# Altium schematic sheet 0168_V12_FAN GENERATION.SchDoc
size 848 x 558 mm
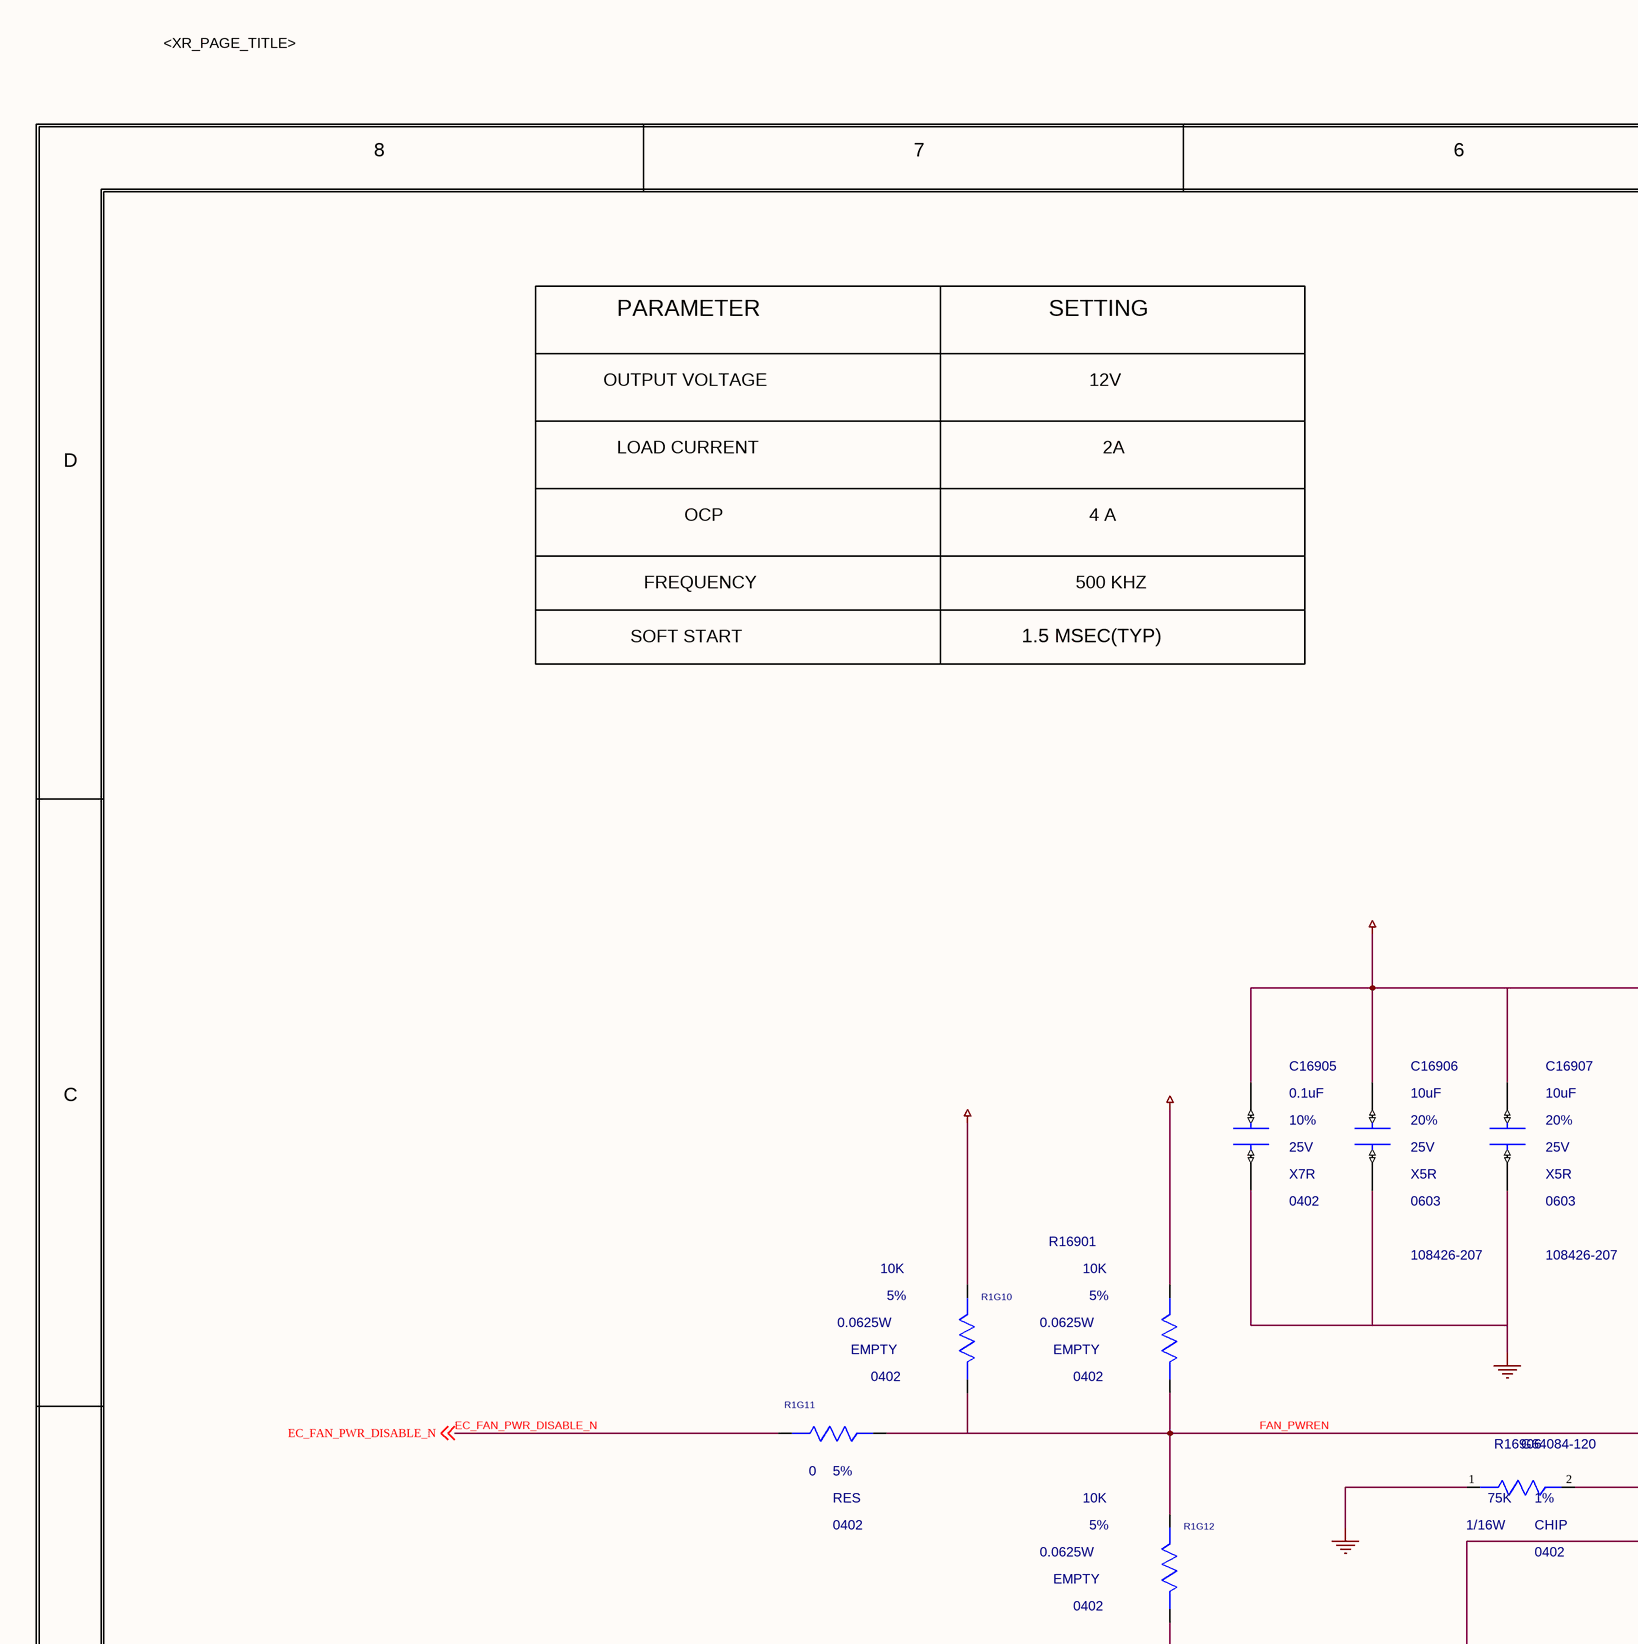
[diagram p0: 0168_V12_FAN GENERATION.SchDoc, top left]
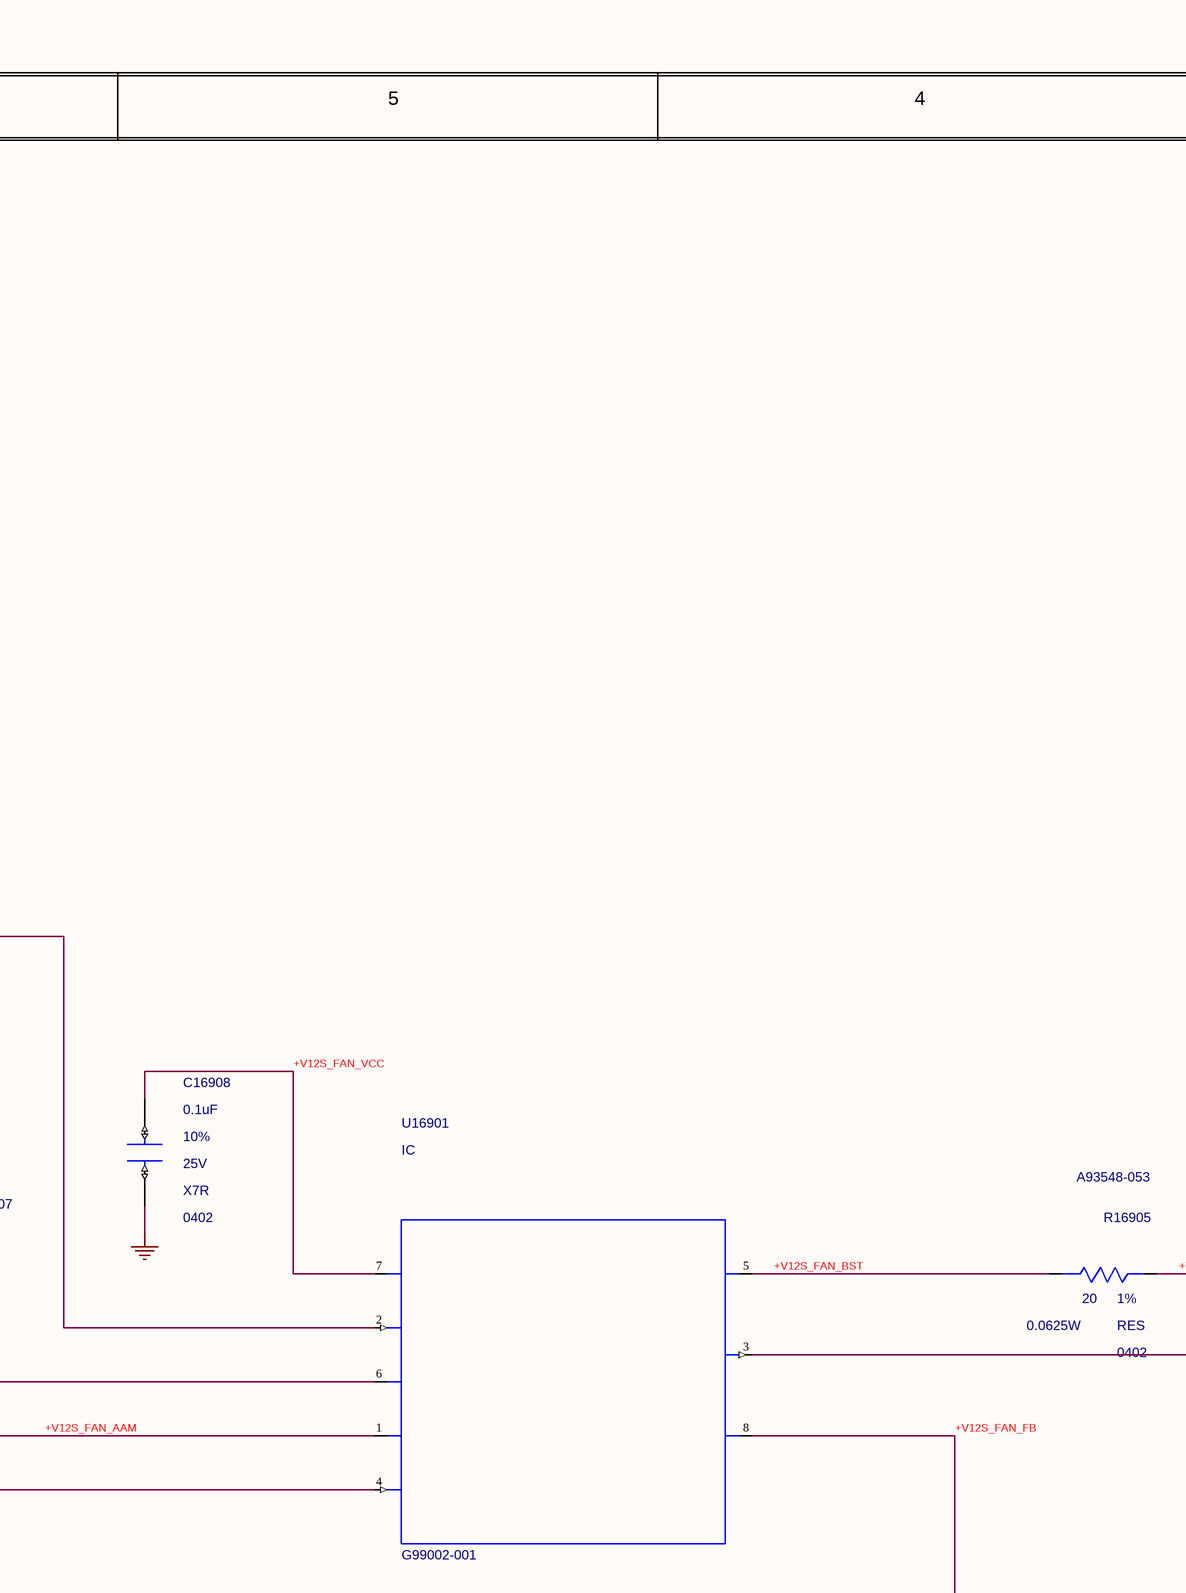
[diagram p1: 0168_V12_FAN GENERATION.SchDoc, top middle]
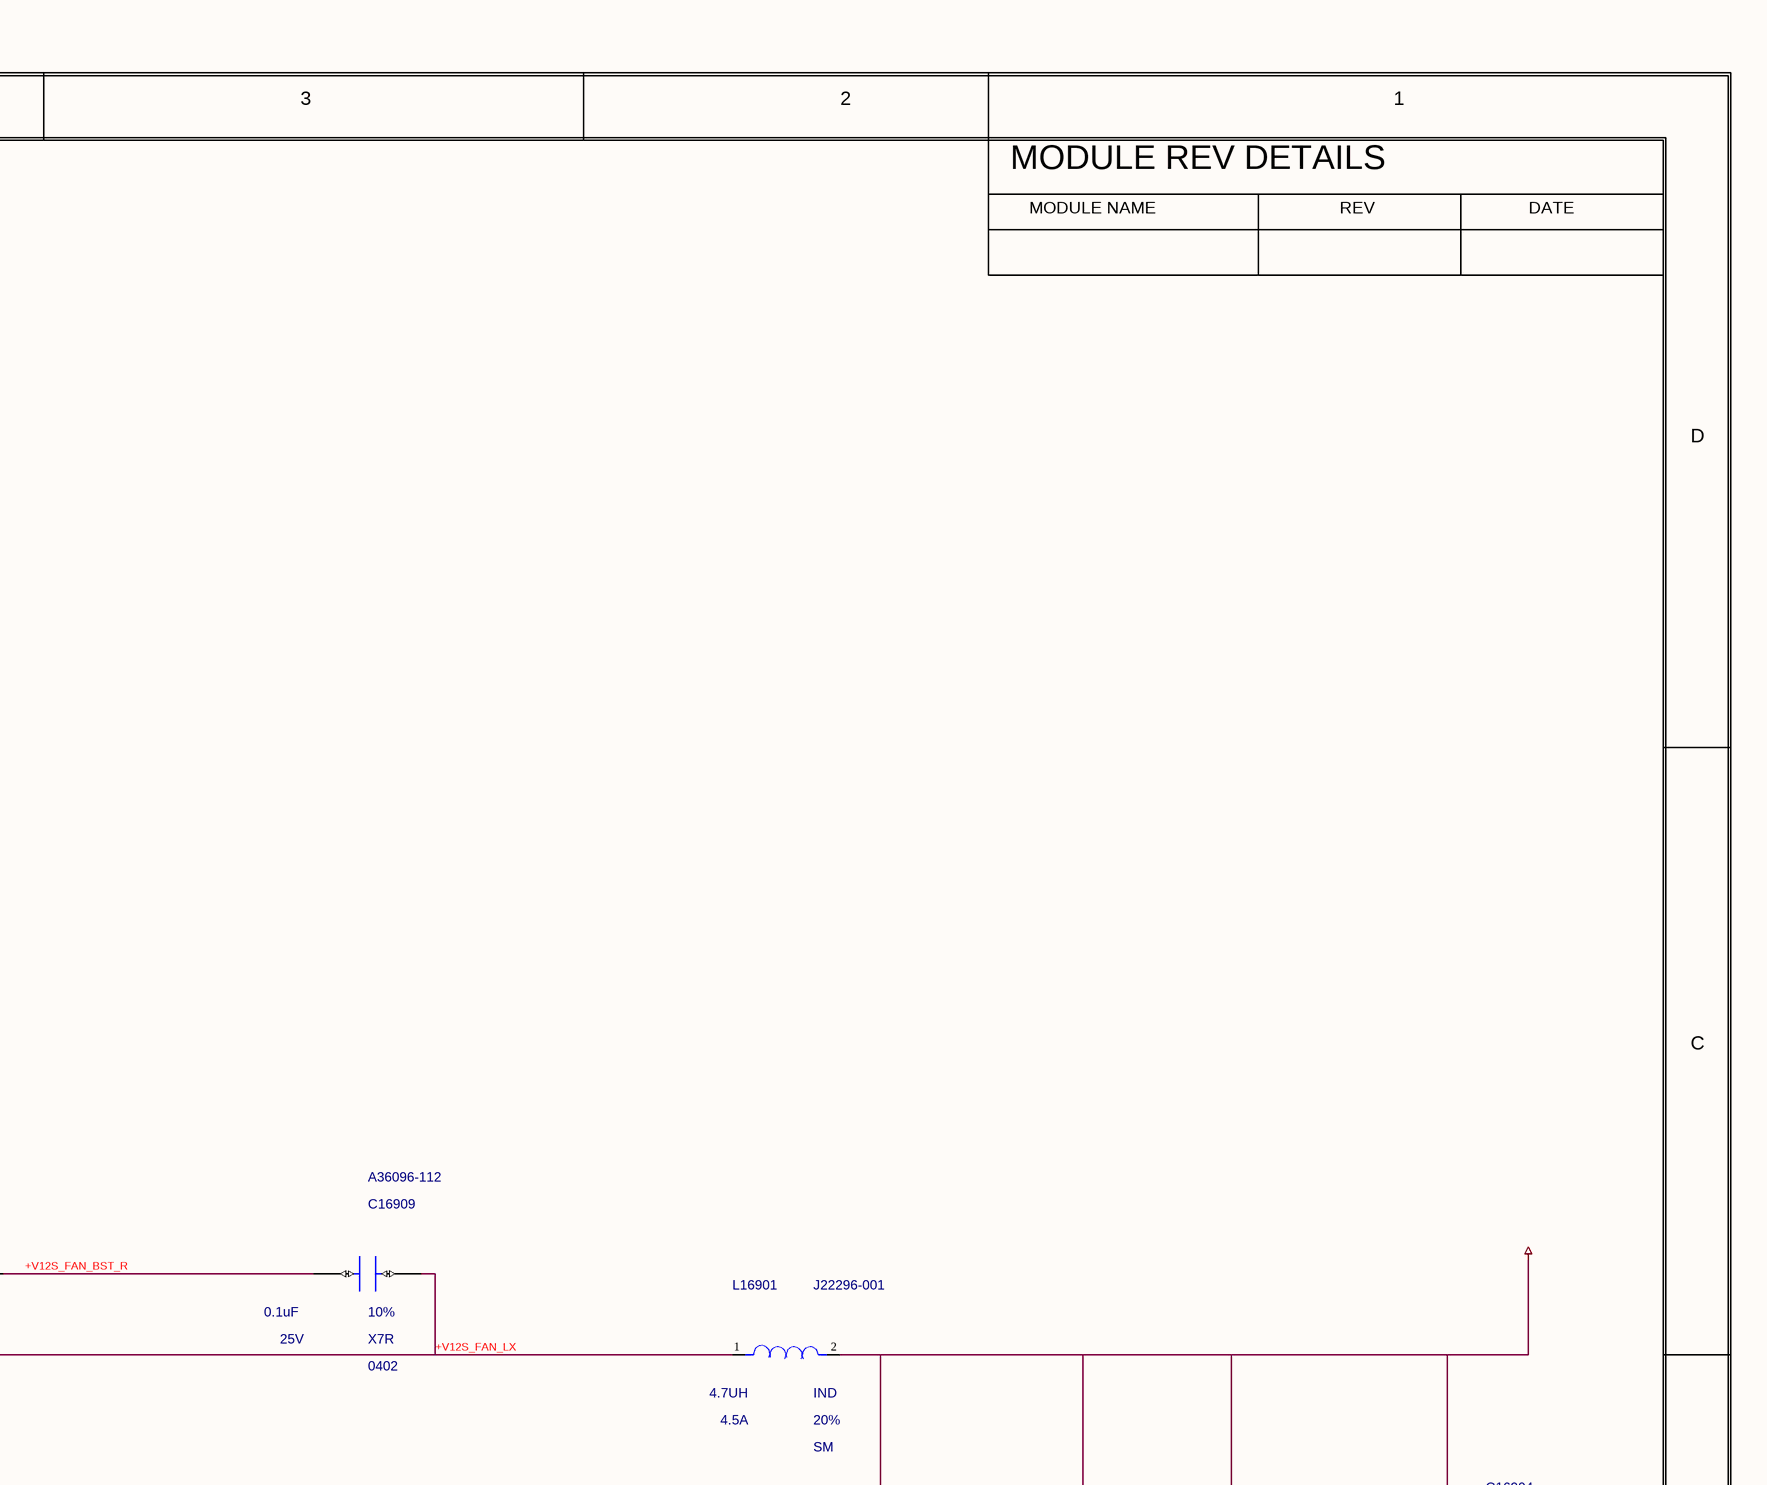
[diagram p2: 0168_V12_FAN GENERATION.SchDoc, top right]
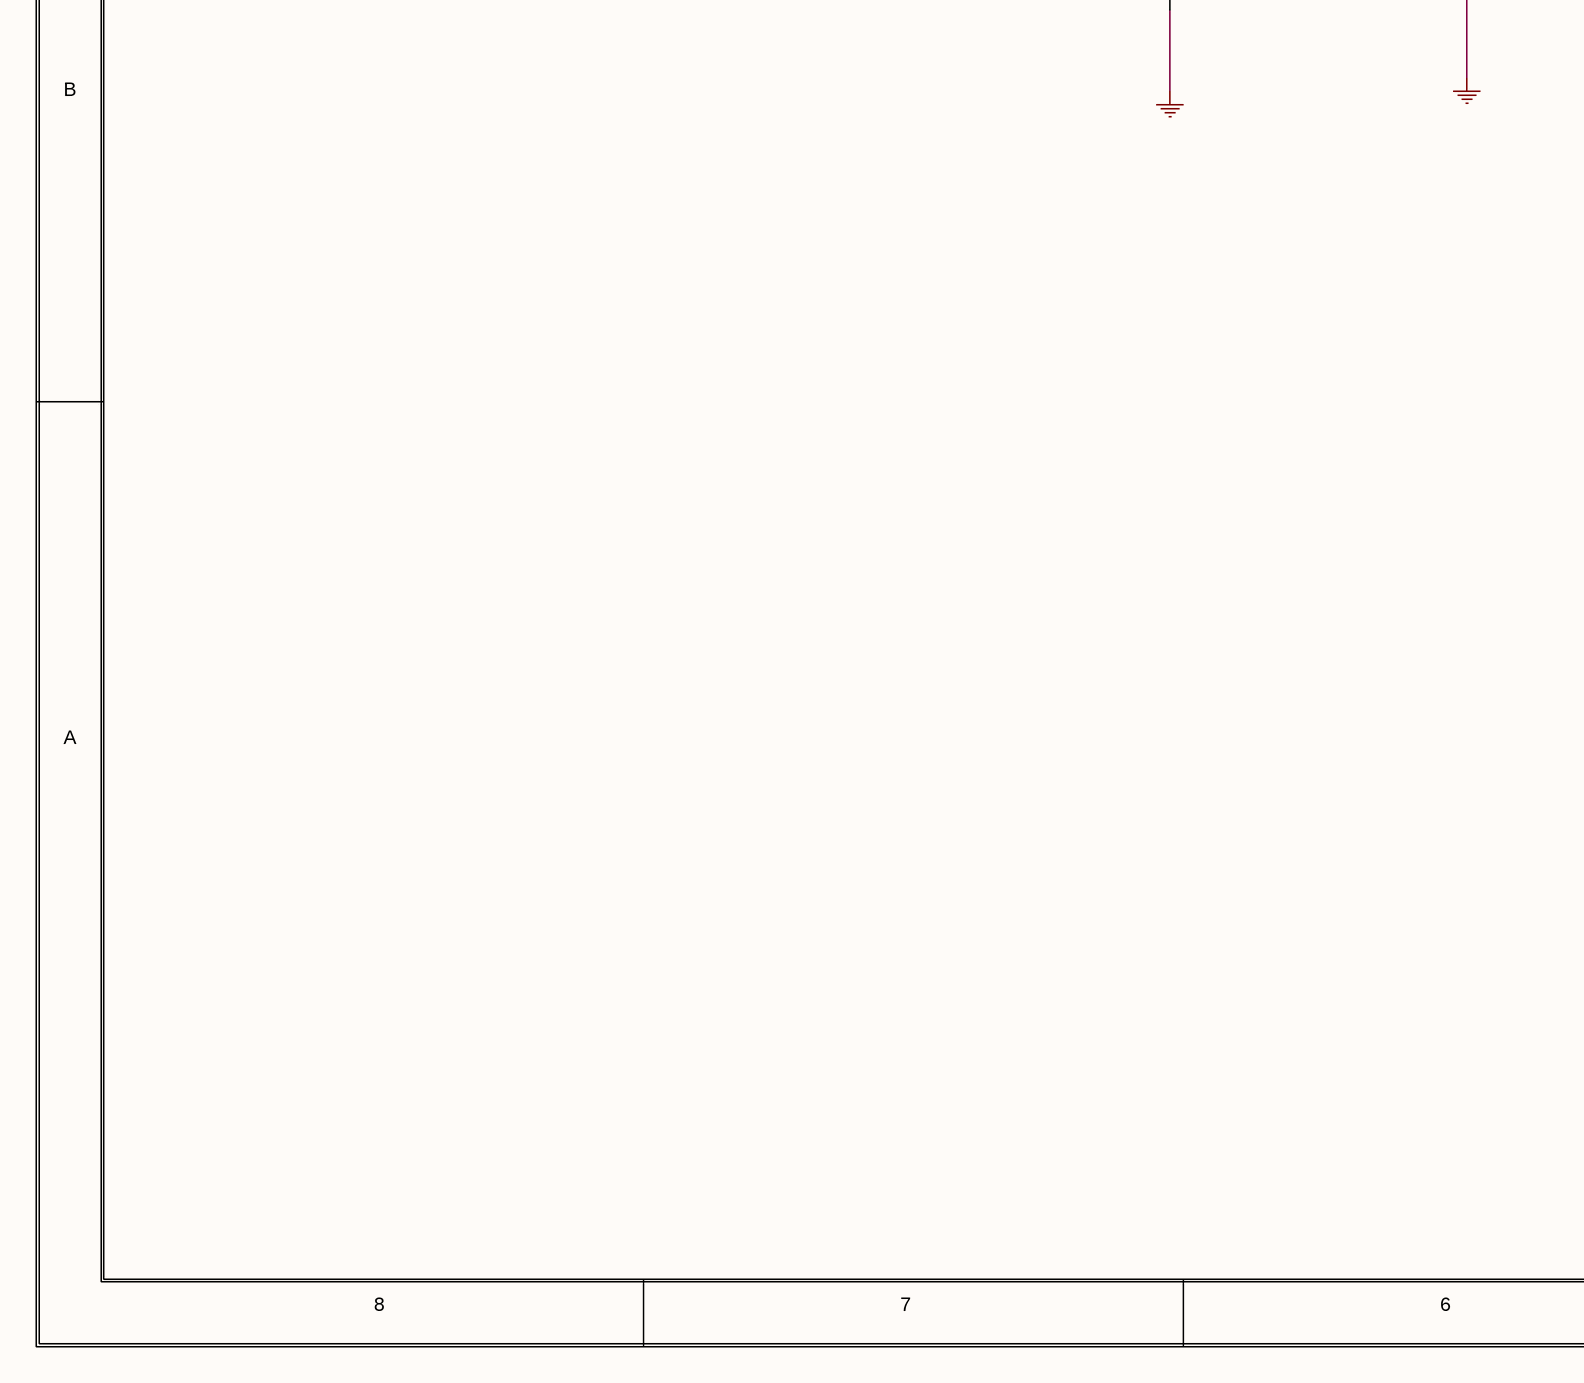
[diagram p3: 0168_V12_FAN GENERATION.SchDoc, bottom left]
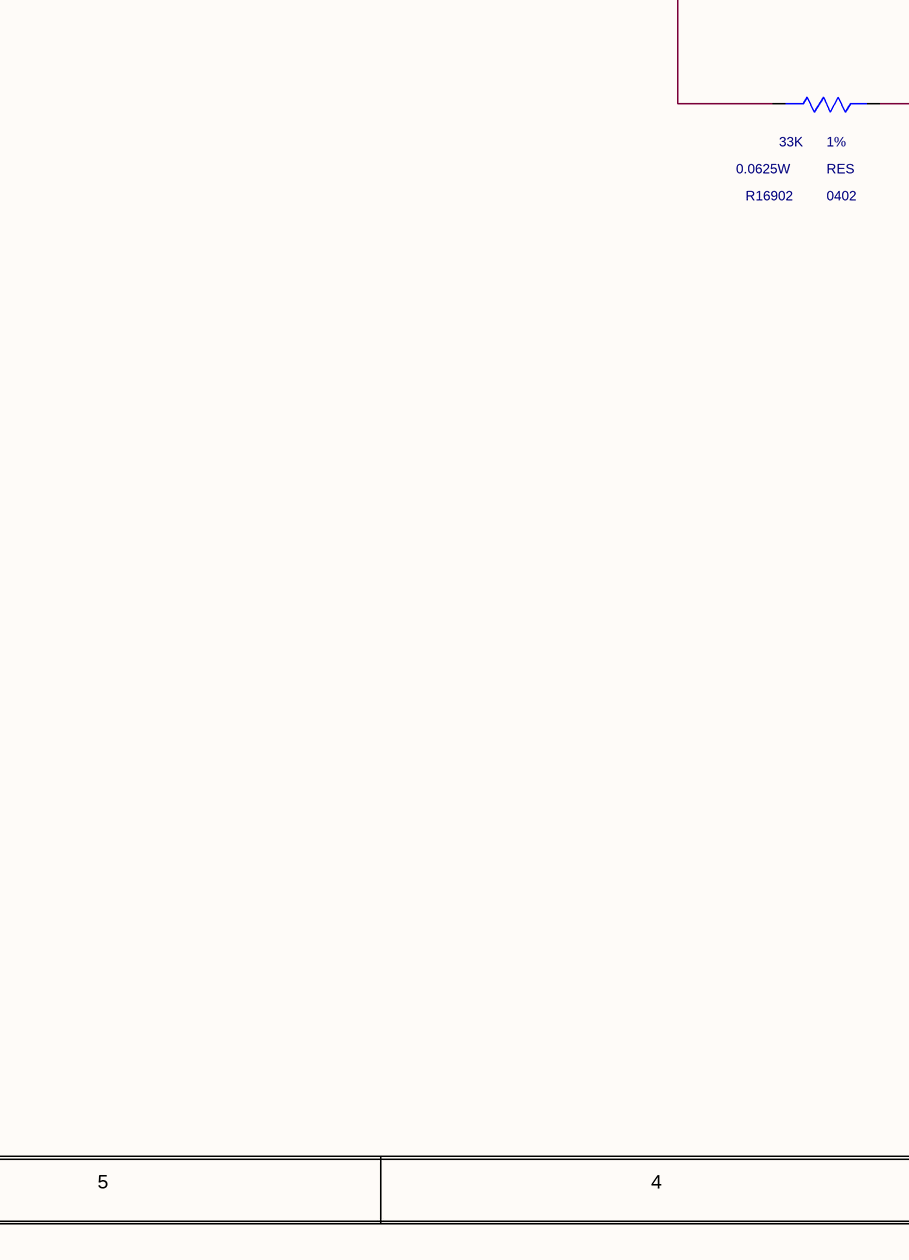
[diagram p4: 0168_V12_FAN GENERATION.SchDoc, bottom middle]
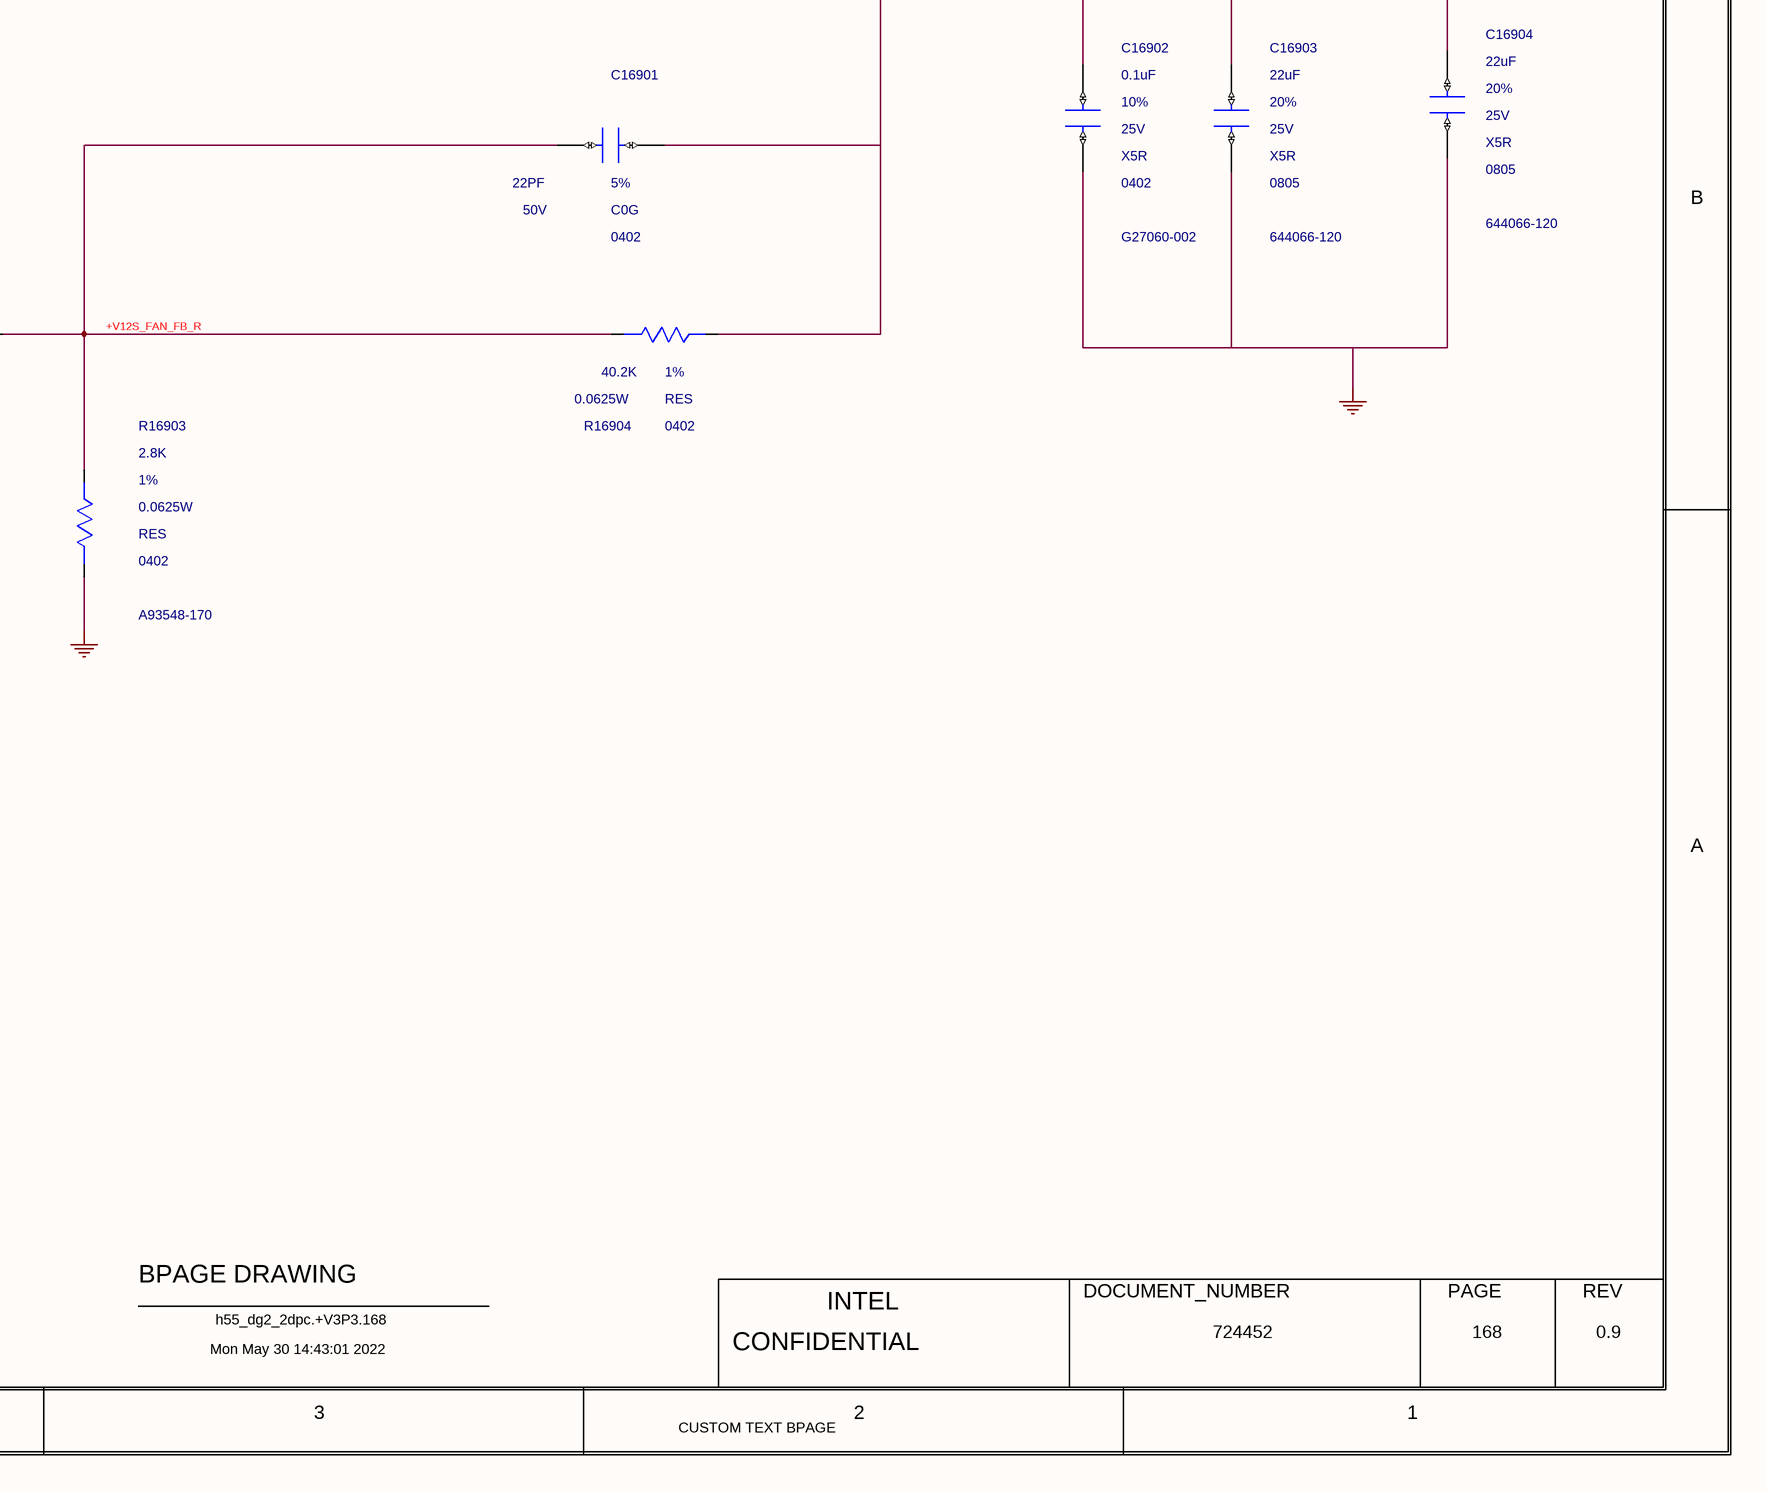
[diagram p5: 0168_V12_FAN GENERATION.SchDoc, bottom right]

## Parts
C16901  22PF  MATERIAL: C0G  PACK_TYPE: 0402  TOLERANCE: 5%  VOLTAGE: 50V  [CTK2_SM0402_1050X550_MA]
C16902  0.1uF  MATERIAL: X5R  PACK_TYPE: 0402  PART_NUMBER: G27060-002  TOLERANCE: 10%  VOLTAGE: 25V  [CTK2_SM0402_1050X550_MA]
C16903  22uF  MATERIAL: X5R  PACK_TYPE: 0805  PART_NUMBER: 644066-120  TOLERANCE: 20%  VOLTAGE: 25V  [CTK2_SM0805_2200X1450_MA]
C16904  22uF  MATERIAL: X5R  PACK_TYPE: 0805  PART_NUMBER: 644066-120  TOLERANCE: 20%  VOLTAGE: 25V  [CTK2_SM0805_2200X1450_MA]
C16905  0.1uF  MATERIAL: X7R  PACK_TYPE: 0402  TOLERANCE: 10%  VOLTAGE: 25V  [CTK2_SM0402_1050X550_MA]
C16906  10uF  MATERIAL: X5R  PACK_TYPE: 0603  PART_NUMBER: 108426-207  TOLERANCE: 20%  VOLTAGE: 25V  [CTK2_SM0603_1800X1000_MA]
C16907  10uF  MATERIAL: X5R  PACK_TYPE: 0603  PART_NUMBER: 108426-207  TOLERANCE: 20%  VOLTAGE: 25V  [CTK2_SM0603_1800X1000_MA]
C16908  0.1uF  MATERIAL: X7R  PACK_TYPE: 0402  TOLERANCE: 10%  VOLTAGE: 25V  [CTK2_SM0402_1050X550_MA]
C16909  0.1uF  MATERIAL: X7R  PACK_TYPE: 0402  PART_NUMBER: A36096-112  TOLERANCE: 10%  VOLTAGE: 25V  [CTK2_SM0402_1050X550_MA]
L16901  4.7UH  CURRENT: 4.5A  MATERIAL: IND  PACK_TYPE: SM  PART_NUMBER: J22296-001  TOLERANCE: 20%  [CTK0_SM_S4300_MB]
R1G10  10K  MATERIAL: EMPTY  PACK_TYPE: 0402  TOLERANCE: 5%  WATTAGE: 0.0625W  [CTK2_SM0402_1100X550_MA]
R1G11  0  MATERIAL: RES  PACK_TYPE: 0402  TOLERANCE: 5%  [CTK2_SM0402_1100X550_MA]
R1G12  10K  MATERIAL: EMPTY  PACK_TYPE: 0402  TOLERANCE: 5%  WATTAGE: 0.0625W  [CTK2_SM0402_1100X550_MA]
R16901  10K  MATERIAL: EMPTY  PACK_TYPE: 0402  TOLERANCE: 5%  WATTAGE: 0.0625W  [CTK2_SM0402_1100X550_MA]
R16902  33K  MATERIAL: RES  PACK_TYPE: 0402  TOLERANCE: 1%  WATTAGE: 0.0625W  [CTK0_SM0402_1050X550_MA]
R16903  2.8K  MATERIAL: RES  PACK_TYPE: 0402  PART_NUMBER: A93548-170  TOLERANCE: 1%  WATTAGE: 0.0625W  [CTK2_SM0402_1100X550_MA]
R16904  40.2K  MATERIAL: RES  PACK_TYPE: 0402  TOLERANCE: 1%  WATTAGE: 0.0625W  [CTK0_SM0402_1100X550_MA]
R16905  20  MATERIAL: RES  PACK_TYPE: 0402  PART_NUMBER: A93548-053  TOLERANCE: 1%  WATTAGE: 0.0625W  [CTK2_SM0402_1100X550_MA]
R16906  75K  MATERIAL: CHIP  PACK_TYPE: 0402  PART_NUMBER: G64084-120  TOLERANCE: 1%  WATTAGE: 1/16W  [SMR0402IA]
U16901  MATERIAL: IC  PART_NUMBER: G99002-001  [CTK2_TSOT23_8_1700X3000_650_MA]  (hidden comment: C_MP2314)

## Nets
+V3P3A: R16901.1(A)
+V3P3S: R1G10.1(A)
+V12S_FAN: C16901.2(B) C16902.1(A) C16903.1(A) C16904.1(A) L16901.2(INB) R16904.2(B)
+VBATA: C16905.1(A) C16906.1(A) C16907.1(A) U16901.2(IN)
GND: C16902.2(B) C16903.2(B) C16904.2(B) C16905.2(B) C16906.2(B) C16907.2(B) C16908.2(B) R1G12.2(B) R16903.2(B) R16906.1(A) U16901.4(GND)
+V12S_FAN_AAM: R16906.2(B) U16901.1(AAM)
+V12S_FAN_BST: R16905.1(A) U16901.5(BST)
+V12S_FAN_BST_R: C16909.1(A) R16905.2(B)
+V12S_FAN_FB: R16902.1(A) U16901.8(FB)
+V12S_FAN_FB_R: C16901.1(A) R16902.2(B) R16903.1(A) R16904.1(A)
+V12S_FAN_LX: C16909.2(B) L16901.1(INA) U16901.3(SW)
+V12S_FAN_VCC: C16908.1(A) U16901.7(VCC)
EC_FAN_PWR_DISABLE_N: R1G11.1(A) ; off-sheet EC_FAN_PWR_DISABLE_N
FAN_PWREN: R1G10.2(B) R1G11.2(B) R1G12.1(A) R16901.2(B) U16901.6(EN_SYNC)

## Notes on the sheet
- <XR_PAGE_TITLE>
- 8
- 7
- 6
- 5
- 4
- 3
- 2
- 1
- MODULE REV DETAILS
- PARAMETER
- SETTING
- MODULE NAME
- REV
- DATE
- OUTPUT VOLTAGE
- 12V
- LOAD CURRENT
- 2A
- D
- OCP
- 4 A
- FREQUENCY
- 500 KHZ
- SOFT START
- 1.5 MSEC(TYP)
- C
- B
- A
- BPAGE DRAWING
- INTEL
- DOCUMENT_NUMBER
- PAGE
- Mon May 30 14:43:01 2022
- h55_dg2_2dpc.+V3P3.168
- CONFIDENTIAL
- 724452
- 168
- 0.9
- CUSTOM TEXT BPAGE

## Library data of the parts
C16901 = C_CAP#1: PART_NUMBER: A36095-030; CHIPS_PART_NAME: C_CAP; CDS_PHYS_PART_NAME: C_CAP_0402-A36095-030,C0G,22PF,50V,5%,TK2,GENERIC; CDS_LMAN_SYM_OUTLINE: -50,50,50,-50; FP_TECH: TK2; IP: GENERIC; ROOM: NONE; OriginalSymbolOrigin: (-25,50); XY: (2000,-375); VER: 2; ROT: 0; PHYS_PAGE: 168; LOCATION: C16901; DRAWING: @RVP1_ADL_SB_ADP_S_DDR5_SODIMM_2DPC_LIB.H55_DG2_2DPC(SCH_1):PAGE537; CDS_LIB: c_discrete; VARIANT: ?; PCB Footprint: CTK2_SM0402_1050X550_MA; CDS_PART_NAME: C_CAP_0402-A36095-030,C0G,22PF,50V,5%,TK2,GENERIC; CDS_LOCATION: C16901
C16902 = C_CAP: CDS_PHYS_PART_NAME: C_CAP_0402-G27060-002,X5R,0.1UF,25V,10%,TK2,GENERIC; CDS_LMAN_SYM_OUTLINE: -50,50,50,-50; FP_TECH: TK2; IP: GENERIC; ROOM: NONE; OriginalSymbolOrigin: (-50,25); XY: (2875,-325); VER: 1; ROT: 0; PHYS_PAGE: 168; LOCATION: C16902; DRAWING: @RVP1_ADL_SB_ADP_S_DDR5_SODIMM_2DPC_LIB.H55_DG2_2DPC(SCH_1):PAGE537; CDS_LIB: c_discrete; VARIANT: ?; PCB Footprint: CTK2_SM0402_1050X550_MA; CHIPS_PART_NAME: C_CAP; CDS_PART_NAME: C_CAP_0402-G27060-002,X5R,0.1UF,25V,10%,TK2,GENERIC; CDS_LOCATION: C16902
C16903 = C_CAP: CDS_PHYS_PART_NAME: C_CAP_0805-644066-120,X5R,22UF,25V,20%,TK2,GENERIC; CDS_LMAN_SYM_OUTLINE: -50,50,50,-50; FP_TECH: TK2; IP: GENERIC; ROOM: NONE; OriginalSymbolOrigin: (-50,25); XY: (3150,-325); VER: 1; ROT: 0; PHYS_PAGE: 168; LOCATION: C16903; DRAWING: @RVP1_ADL_SB_ADP_S_DDR5_SODIMM_2DPC_LIB.H55_DG2_2DPC(SCH_1):PAGE537; CDS_LIB: c_discrete; VARIANT: ?; PCB Footprint: CTK2_SM0805_2200X1450_MA; CHIPS_PART_NAME: C_CAP; CDS_PART_NAME: C_CAP_0805-644066-120,X5R,22UF,25V,20%,TK2,GENERIC; CDS_LOCATION: C16903
C16904 = C_CAP: CDS_PHYS_PART_NAME: C_CAP_0805-644066-120,X5R,22UF,25V,20%,TK2,GENERIC; CDS_LMAN_SYM_OUTLINE: -50,50,50,-50; FP_TECH: TK2; IP: GENERIC; ROOM: NONE; OriginalSymbolOrigin: (-50,25); XY: (3550,-300); VER: 1; ROT: 0; PHYS_PAGE: 168; LOCATION: C16904; DRAWING: @RVP1_ADL_SB_ADP_S_DDR5_SODIMM_2DPC_LIB.H55_DG2_2DPC(SCH_1):PAGE537; CDS_LIB: c_discrete; VARIANT: ?; PCB Footprint: CTK2_SM0805_2200X1450_MA; CHIPS_PART_NAME: C_CAP; CDS_PART_NAME: C_CAP_0805-644066-120,X5R,22UF,25V,20%,TK2,GENERIC; CDS_LOCATION: C16904
C16905 = C_CAP: PART_NUMBER: A36096-112; CDS_PHYS_PART_NAME: C_CAP_0402-A36096-112,X7R,0.1UF,25V,10%,TK2,GENERIC; CDS_LMAN_SYM_OUTLINE: -50,50,50,-50; FP_TECH: TK2; IP: GENERIC; ROOM: NONE; OriginalSymbolOrigin: (-50,25); XY: (-1925,575); VER: 1; ROT: 0; PHYS_PAGE: 168; LOCATION: C16905; DRAWING: @RVP1_ADL_SB_ADP_S_DDR5_SODIMM_2DPC_LIB.H55_DG2_2DPC(SCH_1):PAGE537; CDS_LIB: c_discrete; VARIANT: ?; PCB Footprint: CTK2_SM0402_1050X550_MA; CHIPS_PART_NAME: C_CAP; CDS_PART_NAME: C_CAP_0402-A36096-112,X7R,0.1UF,25V,10%,TK2,GENERIC; CDS_LOCATION: C16905
C16906 = C_CAP: CDS_PHYS_PART_NAME: C_CAP_0603-108426-207,X5R,10UF,25V,20%,TK2,GENERIC; CDS_LMAN_SYM_OUTLINE: -50,50,50,-50; FP_TECH: TK2; IP: GENERIC; ROOM: NONE; OriginalSymbolOrigin: (-50,25); XY: (-1700,575); VER: 1; ROT: 0; PHYS_PAGE: 168; LOCATION: C16906; DRAWING: @RVP1_ADL_SB_ADP_S_DDR5_SODIMM_2DPC_LIB.H55_DG2_2DPC(SCH_1):PAGE537; CDS_LIB: c_discrete; VARIANT: ?; PCB Footprint: CTK2_SM0603_1800X1000_MA; CHIPS_PART_NAME: C_CAP; CDS_PART_NAME: C_CAP_0603-108426-207,X5R,10UF,25V,20%,TK2,GENERIC; CDS_LOCATION: C16906
C16907 = C_CAP: CDS_PHYS_PART_NAME: C_CAP_0603-108426-207,X5R,10UF,25V,20%,TK2,GENERIC; CDS_LMAN_SYM_OUTLINE: -50,50,50,-50; FP_TECH: TK2; IP: GENERIC; ROOM: NONE; OriginalSymbolOrigin: (-50,25); XY: (-1450,575); VER: 1; ROT: 0; PHYS_PAGE: 168; LOCATION: C16907; DRAWING: @RVP1_ADL_SB_ADP_S_DDR5_SODIMM_2DPC_LIB.H55_DG2_2DPC(SCH_1):PAGE537; CDS_LIB: c_discrete; VARIANT: ?; PCB Footprint: CTK2_SM0603_1800X1000_MA; CHIPS_PART_NAME: C_CAP; CDS_PART_NAME: C_CAP_0603-108426-207,X5R,10UF,25V,20%,TK2,GENERIC; CDS_LOCATION: C16907
C16908 = C_CAP: PART_NUMBER: A36096-112; CDS_PHYS_PART_NAME: C_CAP_0402-A36096-112,X7R,0.1UF,25V,10%,TK2,GENERIC; CDS_LMAN_SYM_OUTLINE: -50,50,50,-50; FP_TECH: TK2; IP: GENERIC; ROOM: NONE; OriginalSymbolOrigin: (-50,25); XY: (-1000,450); VER: 1; ROT: 0; PHYS_PAGE: 168; LOCATION: C16908; DRAWING: @RVP1_ADL_SB_ADP_S_DDR5_SODIMM_2DPC_LIB.H55_DG2_2DPC(SCH_1):PAGE537; CDS_LIB: c_discrete; VARIANT: ?; PCB Footprint: CTK2_SM0402_1050X550_MA; CHIPS_PART_NAME: C_CAP; CDS_PART_NAME: C_CAP_0402-A36096-112,X7R,0.1UF,25V,10%,TK2,GENERIC; CDS_LOCATION: C16908
C16909 = C_CAP#1: CHIPS_PART_NAME: C_CAP; CDS_PHYS_PART_NAME: C_CAP_0402-A36096-112,X7R,0.1UF,25V,10%,TK2,GENERIC; CDS_LMAN_SYM_OUTLINE: -50,50,50,-50; FP_TECH: TK2; IP: GENERIC; ROOM: NONE; OriginalSymbolOrigin: (-25,50); XY: (1550,225); VER: 2; ROT: 0; PHYS_PAGE: 168; LOCATION: C16909; DRAWING: @RVP1_ADL_SB_ADP_S_DDR5_SODIMM_2DPC_LIB.H55_DG2_2DPC(SCH_1):PAGE537; CDS_LIB: c_discrete; VARIANT: ?; PCB Footprint: CTK2_SM0402_1050X550_MA; CDS_PART_NAME: C_CAP_0402-A36096-112,X7R,0.1UF,25V,10%,TK2,GENERIC; CDS_LOCATION: C16909
L16901 = C_INDUCTOR: CDS_PHYS_PART_NAME: C_INDUCTOR_SM-J22296-001,IND,4.7UH,20%,4.5A,TK0,GENERIC; CDS_LMAN_SYM_OUTLINE: -100,50,100,-50; FP_TECH: TK0; IP: GENERIC; ROOM: NONE; OriginalSymbolOrigin: (-75,25); XY: (2325,75); VER: 1; ROT: 0; PHYS_PAGE: 168; LOCATION: L16901; DRAWING: @RVP1_ADL_SB_ADP_S_DDR5_SODIMM_2DPC_LIB.H55_DG2_2DPC(SCH_1):PAGE537; CDS_LIB: local; VARIANT: ?; PCB Footprint: CTK0_SM_S4300_MB; CHIPS_PART_NAME: C_INDUCTOR; CDS_PART_NAME: C_INDUCTOR_SM-J22296-001,IND,4.7UH,20%,4.5A,TK0,GENERIC; CDS_LOCATION: L16901
R1G10 = C_RES: PART_NUMBER: A93549-023; CDS_PHYS_PART_NAME: RES_402-10K,1%,402"; CDS_PART_NAME: C_RES_0402-A93549-023,EMPTY,10K,5%,0.0625W,TK2,GENERIC; CDS_LMAN_SYM_OUTLINE: -50,50,50,-50; FP_TECH: TK2; IP: GENERIC; ROOM: NONE; OriginalSymbolOrigin: (-25,75); XY: (-2450,200); VER: 2; PHYS_PAGE: 168; LOCATION: R1G10; DRAWING: @RVP1_ADL_SB_ADP_S_DDR5_SODIMM_2DPC_LIB.H55_DG2_2DPC(SCH_1):PAGE537; CDS_LIB: c_discrete; VARIANT: ?; PCB Footprint: CTK2_SM0402_1100X550_MA; ROT: 2; CHIPS_PART_NAME: C_RES; CDS_LOCATION: R1G10; ASI_MODEL: A93549-023
R1G11 = C_RES#1: PART_NUMBER: A93549-001; CHIPS_PART_NAME: C_RES; CDS_PHYS_PART_NAME: RES_402-0,5%,402"; CDS_PART_NAME: C_RES_0402-A93549-001,RES,0,5%,0.0625W,TK2,GENERIC; CDS_LMAN_SYM_OUTLINE: -50,50,50,-50; FP_TECH: TK2; IP: GENERIC; ROOM: NONE; WATTAGE: 0.0625W; OriginalSymbolOrigin: (-75,25); XY: (-2700,25); VER: 1; PHYS_PAGE: 168; LOCATION: R1G11; DRAWING: @RVP1_ADL_SB_ADP_S_DDR5_SODIMM_2DPC_LIB.H55_DG2_2DPC(SCH_1):PAGE537; CDS_LIB: c_discrete; VARIANT: ?; PCB Footprint: CTK2_SM0402_1100X550_MA; ROT: 0; CDS_LOCATION: R1G11; ASI_MODEL: A93549-001
R1G12 = C_RES: PART_NUMBER: A93549-023; CDS_PHYS_PART_NAME: RES_402-10K,1%,402,E"; CDS_PART_NAME: C_RES_0402-A93549-023,EMPTY,10K,5%,0.0625W,TK2,GENERIC; CDS_LMAN_SYM_OUTLINE: -50,50,50,-50; FP_TECH: TK2; IP: GENERIC; ROOM: NONE; OriginalSymbolOrigin: (-25,75); XY: (-2075,-225); VER: 2; PHYS_PAGE: 168; LOCATION: R1G12; DRAWING: @RVP1_ADL_SB_ADP_S_DDR5_SODIMM_2DPC_LIB.H55_DG2_2DPC(SCH_1):PAGE537; CDS_LIB: c_discrete; VARIANT: ?; PCB Footprint: CTK2_SM0402_1100X550_MA; ROT: 2; CHIPS_PART_NAME: C_RES; CDS_LOCATION: R1G12; ASI_MODEL: A93549-023
R16901 = C_RES: PART_NUMBER: A93549-023; CDS_PHYS_PART_NAME: C_RES_0402-A93549-023,EMPTY,10K,5%,0.0625W,TK2,GENERIC; CDS_LMAN_SYM_OUTLINE: -50,50,50,-50; FP_TECH: TK2; IP: GENERIC; ROOM: NONE; OriginalSymbolOrigin: (-25,75); XY: (-2075,200); VER: 2; PHYS_PAGE: 168; LOCATION: R16901; DRAWING: @RVP1_ADL_SB_ADP_S_DDR5_SODIMM_2DPC_LIB.H55_DG2_2DPC(SCH_1):PAGE537; CDS_LIB: c_discrete; VARIANT: ?; PCB Footprint: CTK2_SM0402_1100X550_MA; ROT: 2; CHIPS_PART_NAME: C_RES; CDS_PART_NAME: C_RES_0402-A93549-023,EMPTY,10K,5%,0.0625W,TK2,GENERIC; CDS_LOCATION: R16901; ASI_MODEL: A93549-023
R16902 = C_RES#1: PART_NUMBER: A93548-640; CHIPS_PART_NAME: C_RES; CDS_PHYS_PART_NAME: C_RES_0402-A93548-640,RES,33K,1%,0.0625W,TK0,GENERIC; CDS_LMAN_SYM_OUTLINE: -50,50,50,-50; FP_TECH: TK0; IP: GENERIC; ROOM: NONE; OriginalSymbolOrigin: (-75,25); XY: (775,-725); VER: 1; ROT: 0; PHYS_PAGE: 168; LOCATION: R16902; DRAWING: @RVP1_ADL_SB_ADP_S_DDR5_SODIMM_2DPC_LIB.H55_DG2_2DPC(SCH_1):PAGE537; CDS_LIB: c_discrete; VARIANT: ?; PCB Footprint: CTK0_SM0402_1050X550_MA; CDS_PART_NAME: C_RES_0402-A93548-640,RES,33K,1%,0.0625W,TK0,GENERIC; CDS_LOCATION: R16902
R16903 = C_RES: CDS_PHYS_PART_NAME: C_RES_0402-A93548-170,RES,2.8K,1%,0.0625W,TK2,GENERIC; CDS_LMAN_SYM_OUTLINE: -50,50,50,-50; FP_TECH: TK2; IP: GENERIC; ROOM: NONE; OriginalSymbolOrigin: (-25,75); XY: (1025,-1075); VER: 2; ROT: 0; PHYS_PAGE: 168; LOCATION: R16903; DRAWING: @RVP1_ADL_SB_ADP_S_DDR5_SODIMM_2DPC_LIB.H55_DG2_2DPC(SCH_1):PAGE537; CDS_LIB: c_discrete; VARIANT: ?; PCB Footprint: CTK2_SM0402_1100X550_MA; CHIPS_PART_NAME: C_RES; CDS_PART_NAME: C_RES_0402-A93548-170,RES,2.8K,1%,0.0625W,TK2,GENERIC; CDS_LOCATION: R16903
R16904 = C_RES#1: PART_NUMBER: A93548-188; CHIPS_PART_NAME: C_RES; CDS_PHYS_PART_NAME: C_RES_0402-A93548-188,RES,40.2K,1%,0.0625W,TK0,GENERIC; CDS_LMAN_SYM_OUTLINE: -50,50,50,-50; FP_TECH: TK0; IP: GENERIC; ROOM: NONE; OriginalSymbolOrigin: (-75,25); XY: (2100,-725); VER: 1; ROT: 0; PHYS_PAGE: 168; LOCATION: R16904; DRAWING: @RVP1_ADL_SB_ADP_S_DDR5_SODIMM_2DPC_LIB.H55_DG2_2DPC(SCH_1):PAGE537; CDS_LIB: c_discrete; VARIANT: ?; PCB Footprint: CTK0_SM0402_1100X550_MA; CDS_PART_NAME: C_RES_0402-A93548-188,RES,40.2K,1%,0.0625W,TK0,GENERIC; CDS_LOCATION: R16904
R16905 = C_RES#1: CHIPS_PART_NAME: C_RES; CDS_PHYS_PART_NAME: C_RES_0402-A93548-053,RES,20,1%,0.0625W,TK2,GENERIC; CDS_LMAN_SYM_OUTLINE: -50,50,50,-50; FP_TECH: TK2; IP: GENERIC; ROOM: NONE; OriginalSymbolOrigin: (-75,25); XY: (775,225); VER: 1; ROT: 0; PHYS_PAGE: 168; LOCATION: R16905; DRAWING: @RVP1_ADL_SB_ADP_S_DDR5_SODIMM_2DPC_LIB.H55_DG2_2DPC(SCH_1):PAGE537; CDS_LIB: c_discrete; VARIANT: ?; PCB Footprint: CTK2_SM0402_1100X550_MA; CDS_PART_NAME: C_RES_0402-A93548-053,RES,20,1%,0.0625W,TK2,GENERIC; CDS_LOCATION: R16905
R16906 = RES#1: CHIPS_PART_NAME: RES; CDS_PHYS_PART_NAME: RES_0402-G64084-120,CHIP,75K,1%,1/16W,LPDB,GENERIC; OriginalSymbolOrigin: (-75,25); XY: (-1425,-75); VER: 1; ROT: 0; PHYS_PAGE: 168; LOCATION: R16906; IP: GENERIC; FP_TECH: LPDB; DRAWING: @RVP1_ADL_SB_ADP_S_DDR5_SODIMM_2DPC_LIB.H55_DG2_2DPC(SCH_1):PAGE537; CDS_LIB: discrete; PCB Footprint: SMR0402IA; CDS_PART_NAME: RES_0402-G64084-120,CHIP,75K,1%,1/16W,LPDB,GENERIC; CDS_LOCATION: R16906
U16901 = C_MP2314: CDS_PHYS_PART_NAME: C_MP2314_TSOT23-G99002-001,IC,MP2314GJ,TK2,GENERIC; CDS_LMAN_SYM_OUTLINE: -300,300,300,-300; FP_TECH: TK2; IP: GENERIC; PACK_TYPE: TSOT23; ROOM: NONE; OriginalSymbolOrigin: (-325,300); XY: (-225,25); VER: 1; ROT: 0; PHYS_PAGE: 168; LOCATION: U16901; DRAWING: @RVP1_ADL_SB_ADP_S_DDR5_SODIMM_2DPC_LIB.H55_DG2_2DPC(SCH_1):PAGE537; CDS_LIB: local; VARIANT: ?; PCB Footprint: CTK2_TSOT23_8_1700X3000_650_MA; SEC_TYPE: TSOT23; CHIPS_PART_NAME: C_MP2314; CDS_PART_NAME: C_MP2314_TSOT23-G99002-001,IC,MP2314GJ,TK2,GENERIC; CDS_LOCATION: U16901